# Altium project RGB_SL.PrjPcb
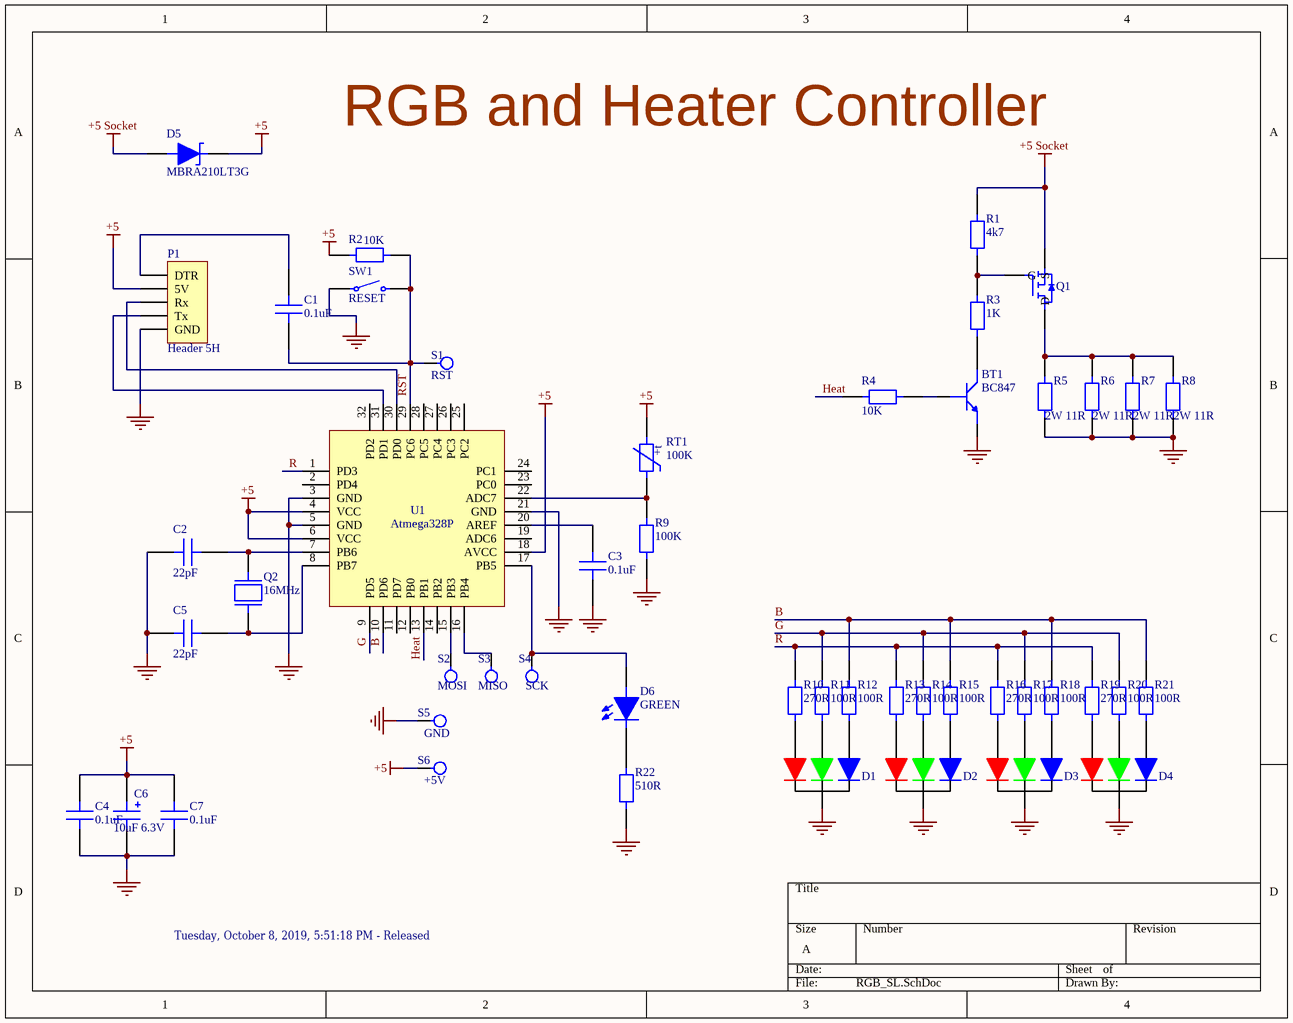
[diagram p0: RGB_SL.SchDoc]
1 sheet, 48 parts. Net scope: global (net labels, ports and power ports of the same name join across sheets).
Board file: RGB_SL.PcbDoc

## Sheet RGB_SL.SchDoc
size A

### Parts
BT1  BC847  [SOT95P240X100-3M]
C1  0.1uF  [0805 Ceramic Capacitor]
C2  22pF  [0805 Ceramic Capacitor]
C3  0.1uF  [0805 Ceramic Capacitor]
C4  0.1uF  [0805 Ceramic Capacitor]
C5  22pF  [0805 Ceramic Capacitor]
C6  10uF 6.3V  [CAP MP3216X16M]
C7  0.1uF  [0805 Ceramic Capacitor]
D1  LED RGB  [LED RGB]  (value not drawn)
D2  LED RGB  [LED RGB]  (value not drawn)
D3  LED RGB  [LED RGB]  (value not drawn)
D4  LED RGB  [LED RGB]  (value not drawn)
D5  MBRA210LT3G  [DIOM4326X22M]
D6  GREEN  [Led G]
P1  Header 5H  [HDR1X5H]
Q1  MOSFET P-Ch  [DPAK254P1524X483-3M]  (value not drawn)
Q2  16MHz  [Crystal]
R1  4k7  [0805 Res]
R2  10K  [0805 Res]
R3  1K  [0805 Res]
R4  10K  [0805 Res]
R5  2W 11R  [RES T/H 2W]
R6  2W 11R  [RES T/H 2W]
R7  2W 11R  [RES T/H 2W]
R8  2W 11R  [RES T/H 2W]
R9  100K  [0805 Res]
R10  270R  [1206 RES]
R11  100R  [1206 RES]
R12  100R  [1206 RES]
R13  270R  [1206 RES]
R14  100R  [1206 RES]
R15  100R  [1206 RES]
R16  270R  [1206 RES]
R17  100R  [1206 RES]
R18  100R  [1206 RES]
R19  270R  [1206 RES]
R20  100R  [1206 RES]
R21  100R  [1206 RES]
R22  510R  [0805 Res]
RT1  100K  [THERMISTOR]
S1  RST  [Test Pad]  (no BOM)
S2  MOSI  [Test Pad]  (no BOM)
S3  MISO  [Test Pad]  (no BOM)
S4  SCK  [Test Pad]  (no BOM)
S5  GND  [Test Pad]  (no BOM)
S6  +5V  [Test Pad]  (no BOM)
SW1  RESET  [SWITCH]
U1  Atmega328P  [TQFP80P900X900X120-32M]

### Nets
+5: C4.2 C6.1 C7.2 D5.1 P1.2(5V) R2.1 RT1.2 S6.1 U1.4(VCC) U1.6(VCC) U1.18(AVCC)
+5 Socket: D5.2 Q1.3(S) R1.2
GND: BT1.2 C2.1 C3.1 C4.1 C5.1 C6.2 C7.1 D1.3 D2.3 D3.3 D4.3 P1.5(GND) R5.1 R6.1 R7.1 R8.1 R9.1 R22.1 S5.1 SW1.1 U1.3(GND) U1.5(GND) U1.21(GND)
B: R12.2 R15.2 R18.2 R21.2 U1.10(PD6)
G: R11.2 R14.2 R17.2 R20.2 U1.9(PD5)
Heat: R4.1 U1.13(PB1)
R: R10.2 R13.2 R16.2 R19.2 U1.1(PD3)
RST: C1.1 R2.2 S1.1 SW1.2 U1.29(PC6)
NetBT1_1: BT1.1 R4.2
NetBT1_3: BT1.3 R3.1
NetC1_2: C1.2 P1.1(DTR)
NetC2_2: C2.2 Q2.1 U1.7(PB6)
NetC3_2: C3.2 U1.20(AREF)
NetC5_2: C5.2 Q2.2 U1.8(PB7)
NetD1_1: D1.1(B) R12.1
NetD1_2: D1.2(R) R10.1
NetD1_4: D1.4(G) R11.1
NetD2_1: D2.1(B) R15.1
NetD2_2: D2.2(R) R13.1
NetD2_4: D2.4(G) R14.1
NetD3_1: D3.1(B) R18.1
NetD3_2: D3.2(R) R16.1
NetD3_4: D3.4(G) R17.1
NetD4_1: D4.1(B) R21.1
NetD4_2: D4.2(R) R19.1
NetD4_4: D4.4(G) R20.1
NetD6_1: D6.1 S4.1 U1.17(PB5)
NetD6_2: D6.2 R22.2
NetP1_3: P1.3(Tx) U1.31(PD1)
NetP1_4: P1.4(Rx) U1.30(PD0)
NetQ1_1: Q1.1(G) R1.1 R3.2
NetQ1_4: Q1.4(D) R5.2 R6.2 R7.2 R8.2
NetR9_2: R9.2 RT1.1 U1.22(ADC7)
NetS2_1: S2.1 U1.15(PB3)
NetS3_1: S3.1 U1.16(PB4)

Not connected (* = marked no-connect by the designer): U1 2(PD4) 11(PD7) 12(PB0) 14(PB2) 19(ADC6) 23(PC0) 24(PC1) 25(PC2) 26(PC3) 27(PC4) 28(PC5) 32(PD2)

### Notes on the sheet
- RGB and Heater Controller
- ‎Tuesday, ‎October ‎8, ‎2019, ‏‎5:51:18 PM - Released
- (in symbol MF52A1104J3950) +t

### Library data of the parts
BT1 = BC847AE6327: Trans NPN 45V 0.1A Automotive 3-Pin SOT-23 T/R GP BJT; Manufacturer: Infineon; Max Power Dissipation: 330mW; Frequency: 250MHz; Max Collector Current: 100mA; Collector Emitter Voltage (VCEO): 600mV; Collector Base Voltage (VCBO): 50V; Number of Elements: 1; Emitter Base Voltage (VEBO): 6V; Supplier 1: Digi-Key; Supplier Part Number 1: BC847AE6327HTSA1CT-ND; Manufacturer Part Number: BC847AE6327; Stock 1: 58887; Pricing 1: 1=0.19, 10=0.175, 100=0.0951, 500=0.0585, 1000=0.0399 (USD); Mount: Surface Mount; Case/Package: SOT-23-3; Number of Pins: 3; Min Operating Temperature: -65°C; Max Operating Temperature: 150°C; Packaging: Tape and Reel; Polarity: NPN; Transition Frequency: 250MHz; Collector Emitter Breakdown Voltage: 45V; Max Breakdown Voltage: 45V; Power Dissipation: 330mW; Current Rating: 100mA; Voltage Rating (DC): 45V; Radiation Hardening: No; Lead Free: Lead Free; Halogen Free: Not Halogen Free; ComponentLink1URL: http://www.infineon.com/dgdl/bc847series_bc848series_bc849series_bc850series.pdf?folderId=db3a304314dca389011541d30fa21656&fileId=db3a304314dca389011541d4630a1657&src-supplier=Avnet; ComponentLink1Description: http://www.infineon.com/dgdl/bc847series_bc848series_bc849series_bc850series.pdf?folderId=db3a304314dca389011541d30fa21656&fileId=db3a304314dca389011541d4630a1657&src-supplier=Avnet; ComponentLink2URL: http://www.mouser.com/ds/2/196/bc847series_bc848series_bc849series_bc850series-55535.pdf?src-supplier=Mouser; ComponentLink2Description: http://www.mouser.com/ds/2/196/bc847series_bc848series_bc849series_bc850series-55535.pdf?src-supplier=Mouser; ComponentLink3URL: https://www.infineon.com/dgdl/Infineon-BC847SERIES_BC848SERIES_BC849SERIES_BC850SERIES-DS-v01_01-en.pdf?fileId=db3a304314dca389011541d4630a1657&src-supplier=Digi-Key; ComponentLink3Description: https://www.infineon.com/dgdl/Infineon-BC847SERIES_BC848SERIES_BC849SERIES_BC850SERIES-DS-v01_01-en.pdf?fileId=db3a304314dca389011541d4630a1657&src-supplier=Digi-Key; ComponentLink4URL: http://components.arrow.com/part/dataview/53356285S7690205N2051?src-supplier=Arrow; ComponentLink4Description: http://components.arrow.com/part/dataview/53356285S7690205N2051?src-supplier=Arrow; ComponentLink5URL: http://components.arrow.com/part/dataview/0323_00171840?src-supplier=Arrow+Europe; ComponentLink5Description: http://components.arrow.com/part/dataview/0323_00171840?src-supplier=Arrow+Europe; ComponentLink6URL: https://www.verical.com/server-webapp/html/getDatasheet?partID=730888&src-supplier=Verical; ComponentLink6Description: https://www.verical.com/server-webapp/html/getDatasheet?partID=730888&src-supplier=Verical; Category: Transistors
C1 C3 C4 C7 = VJ0805Y104KXAAT: Ceramic Cap 0.1uF 50 V 10% MLCC - SMD/SMT; Manufacturer: Vishay Vitramon; Capacitance: 100nF; Voltage Rating: 50V; Dielectric: X7R; Supplier 1: Digi-Key; Supplier Part Number 1: 720-1383-1-ND; Manufacturer Part Number: VJ0805Y104KXAAT; Stock 1: 151633; Pricing 1: 1=0.34, 10=0.234, 100=0.1404, 500=0.1053, 1000=0.0889 (USD); Mount: Surface Mount; Case/Package: 0805; Weight: 0.000194oz; Case Code (Metric): 2012; Case Code (Imperial): 0805; Min Operating Temperature: -55°C; Max Operating Temperature: 125°C; Package Quantity: 1; Packaging: Tape and Reel; Tolerance: 10%; Voltage Rating (DC): 50V; Termination: SMD/SMT; Voltage: 50V; Length: 2mm; Height: 1.45mm; Width: 0.049inch; Thickness: 0.057inch; Depth: 1.25mm; Radiation Hardening: No; REACH SVHC: Unknown; Lead Free: Lead Free; ComponentLink1URL: http://www.mouser.com/ds/2/427/vjcommercialseries-222796.pdf?src-supplier=Mouser; ComponentLink1Description: http://www.mouser.com/ds/2/427/vjcommercialseries-222796.pdf?src-supplier=Mouser; ComponentLink2URL: http://www.vishay.com/docs/45199/vjcommercialseries.pdf?src-supplier=Digi-Key; ComponentLink2Description: http://www.vishay.com/docs/45199/vjcommercialseries.pdf?src-supplier=Digi-Key; ComponentLink3URL: http://www.vishay.com/docs/45199/vjcommercialseries.pdf?src-supplier=Future+Electronics; ComponentLink3Description: http://www.vishay.com/docs/45199/vjcommercialseries.pdf?src-supplier=Future+Electronics; Category: Capasitors
C2 C5 = VJ0805A220JXACW1BC: Ceramic Cap 22 pF 50 V ±5 % Tolerance C0G/NP0 SMT Multilayer; Manufacturer: Vishay; Dielectric Material: Tantalum; Tolerance: 5%; Voltage Rating: 50V; Dielectric: C0G; Temperature Coefficient: 0ppm/°C; Supplier 1: Digi-Key; Supplier Part Number 1: 720-1601-1-ND; Manufacturer Part Number: VJ0805A220JXACW1BC; Stock 1: 7193; Pricing 1: 1=0.19, 10=0.13, 100=0.0661, 500=0.0452, 1000=0.04 (USD); Mount: Surface Mount; Case/Package: 0805; Number of Pins: 2; Case Code (Imperial): 0805; Case Code (Metric): 2012; Min Operating Temperature: -55°C; Max Operating Temperature: 125°C; Capacitance: 22pF; Packaging: Tape and Reel; Voltage Rating (DC): 50V; Package Quantity: 4000; Termination: SMD/SMT; Length: 2mm; Height: 1.45mm; Width: 1.25mm; Thickness: 0.03inch; Depth: 1.25mm; Radiation Hardening: No; Lead Free: Lead Free; ComponentLink1URL: http://www.vishay.com/docs/28548/vjw1bcbascomseries.pdf?src-supplier=Future+Electronics; ComponentLink1Description: http://www.vishay.com/docs/28548/vjw1bcbascomseries.pdf?src-supplier=Future+Electronics; ComponentLink2URL: http://www.vishay.com/docs/28548/vjw1bcbascomseries.pdf?src-supplier=Digi-Key; ComponentLink2Description: http://www.vishay.com/docs/28548/vjw1bcbascomseries.pdf?src-supplier=Digi-Key; Category: Capasitors
C6 = 293D106X96R3A2TE3: CAP TANT 10UF 6.3V 10% 1206; Manufacturer: Vishay Sprague; Dielectric Material: Tantalum; ESR (Equivalent Series Resistance): 3.4R; Ripple Current: 150mA; Leakage Current: 600nA; Polarity: Polar; Dissipation Factor: 6%; Q Factor: 6; Supplier 1: Digi-Key; Supplier Part Number 1: 718-1126-1-ND; Manufacturer Part Number: 293D106X96R3A2TE3; Stock 1: 57716; Pricing 1: 1=0.3, 10=0.212, 100=0.127, 500=0.0952, 1000=0.0804 (USD); Mount: Surface Mount,PCB; Case/Package: 1206; Case Code (Metric): 3216; Case Code (Imperial): 1206; Min Operating Temperature: -55°C; Max Operating Temperature: 125°C; Capacitance: 10uF; Tolerance: 10%; Voltage Rating: 6.3V; Packaging: Tape and Reel; Voltage Rating (DC): 6.3V; Package Quantity: 1; Termination: SMD/SMT; Voltage: 6.3V; Features: General Purpose; Length: 3.2mm; Height: 1.6mm; Width: 1.6mm; Height - Seated (Max): 0.071inch; Depth: 1.6mm; Radiation Hardening: No; REACH SVHC: Unknown; Lead Free: Lead Free; ComponentLink1URL: http://www.vishay.com/docs/40002/293d.pdf?src-supplier=Avnet; ComponentLink1Description: http://www.vishay.com/docs/40002/293d.pdf?src-supplier=Avnet; ComponentLink2URL: http://www.farnell.com/datasheets/2045658.pdf?src-supplier=Element14; ComponentLink2Description: http://www.farnell.com/datasheets/2045658.pdf?src-supplier=Element14; ComponentLink3URL: http://documents.rs-components.com/techlib://itc_doclist_GB.htm?stockno=6843913&src-supplier=RSComponents; ComponentLink3Description: http://documents.rs-components.com/techlib://itc_doclist_GB.htm?stockno=6843913&src-supplier=RSComponents; ComponentLink4URL: https://www.alliedelec.com/m/d/7dc9f301682605e5c5665c787edb7bb9.pdf?src-supplier=Allied+Electronics; ComponentLink4Description: https://www.alliedelec.com/m/d/7dc9f301682605e5c5665c787edb7bb9.pdf?src-supplier=Allied+Electronics; ComponentLink5URL: http://www.vishay.com/docs/40002/293d.pdf?src-supplier=Digi-Key; ComponentLink5Description: http://www.vishay.com/docs/40002/293d.pdf?src-supplier=Digi-Key; ComponentLink6URL: http://www.mouser.com/ds/2/427/293d-239871.pdf?src-supplier=Mouser; ComponentLink6Description: http://www.mouser.com/ds/2/427/293d-239871.pdf?src-supplier=Mouser; ComponentLink7URL: http://www.vishay.com/docs/40002/293d.pdf?src-supplier=Avnet+Europe; ComponentLink7Description: http://www.vishay.com/docs/40002/293d.pdf?src-supplier=Avnet+Europe; ComponentLink8URL: http://www.farnell.com/datasheets/438417.pdf?src-supplier=Element14; ComponentLink8Description: http://www.farnell.com/datasheets/438417.pdf?src-supplier=Element14; Category: Capacitors
D1-D4 = HV-5RGB25: LED RGB DIFFUSED 5MM T/H; Manufacturer: Inolux; Color: Blue,Green,Red; Lens Color: Colorless; Lens Style: Round,Domed; Element Configuration: Common Cathode; Lens Transparency: Clear; Luminous Intensity: 2000mcd; Forward Voltage: 3.4V; Test Current: 20mA; Viewing Angle: 25°; Dominant Wavelength: 470nm; Supplier 1: Digi-Key; Supplier Part Number 1: 1830-1015-ND; Manufacturer Part Number: HV-5RGB25; Stock 1: 3004; Pricing 1: 1=1.02, 10=0.829, 100=0.51, 500=0.4335, 1000=0.357, 2500=0.3392, 5000=0.3315, 10000=0.3239, 25000=0.3188 (USD); Mount: Through Hole; Case/Package: Radial; Packaging: Bulk; Height: 8.9mm; Lens Size: 5mm; ComponentLink1URL: http://www.inolux-corp.com/datasheet/Inolux%20Lamp/TH%20Lamp/HV-5RGBXX%205mm%20Full-Color%20Series.pdf?src-supplier=Digi-Key; ComponentLink1Description: http://www.inolux-corp.com/datasheet/Inolux%20Lamp/TH%20Lamp/HV-5RGBXX%205mm%20Full-Color%20Series.pdf?src-supplier=Digi-Key; Category: Optoelectronics
D5 = MBRA210LT3G: DIODE SCHOTTKY 10V 2A SMA; Manufacturer: ON Semiconductor; Max Surge Current: 160A; Forward Voltage: 350mV; Peak Reverse Current: 700uA; Element Configuration: Single; Polarity: Standard; Supplier 1: Digi-Key; Supplier Part Number 1: MBRA210LT3GOSCT-ND; Manufacturer Part Number: MBRA210LT3G; Stock 1: 23902; Pricing 1: 1=0.48, 10=0.411, 100=0.3072, 500=0.2413, 1000=0.1865 (USD); Case/Package: CASE 403D SMA; Number of Pins: 2; Contact Plating: Tin,Matte; Min Operating Temperature: -55°C; Max Operating Temperature: 125°C; Package Quantity: 1; Forward Current: 2A; Packaging: Tape and Reel; Average Rectified Current: 2A; Max Reverse Leakage Current: 700uA; Max Repetitive Reverse Voltage (Vrrm): 10V; Max Forward Surge Current (Ifsm): 160A; Peak Non-Repetitive Surge Current: 160A; Voltage Rating (DC): 10V; Current Rating: 2A; Output Current: 2A; Max Reverse Voltage (DC): 10V; Length: 4.57mm; Height: 2.05mm; Width: 2.92mm; Radiation Hardening: No; REACH SVHC: No SVHC; Lead Free: Lead Free; Halogen Free: Halogen Free; ComponentLink1URL: http://www.onsemi.com/pub/Collateral/MBRA210LT3-D.PDF?src-supplier=Digi-Key; ComponentLink1Description: http://www.onsemi.com/pub/Collateral/MBRA210LT3-D.PDF?src-supplier=Digi-Key; ComponentLink2URL: http://www.mouser.com/ds/2/308/MBRA210LT3-D-76406.pdf?src-supplier=Mouser; ComponentLink2Description: http://www.mouser.com/ds/2/308/MBRA210LT3-D-76406.pdf?src-supplier=Mouser; ComponentLink3URL: http://www.farnell.com/datasheets/1796182.pdf?src-supplier=Element14; ComponentLink3Description: http://www.farnell.com/datasheets/1796182.pdf?src-supplier=Element14; ComponentLink4URL: http://www.onsemi.com/pub/Collateral/MBRA210LT3-D.PDF?src-supplier=Avnet; ComponentLink4Description: http://www.onsemi.com/pub/Collateral/MBRA210LT3-D.PDF?src-supplier=Avnet; ComponentLink5URL: http://www.onsemi.com/pub/Collateral/MBRA210LT3-D.PDF?src-supplier=Future+Electronics; ComponentLink5Description: http://www.onsemi.com/pub/Collateral/MBRA210LT3-D.PDF?src-supplier=Future+Electronics; Category: Diodes
D6 = CMD17-21VGD/TR8: LED GREEN DIFFUSED 0805 SMD; Manufacturer: VCC CHML; Luminous Intensity: 7mcd; Viewing Angle: 140°; Forward Voltage: 2.1V; Wavelength: 570nm; Lens Style: Rectangular,Diffused,Tinted,Colored; Forward Current: 20mA; Power Rating: 105mW; Number of Elements: 1; Reverse Voltage (DC): 5V; Supplier 1: Digi-Key; Supplier Part Number 1: L62505CT-ND; Manufacturer Part Number: CMD17-21VGD/TR8; Stock 1: 7282; Pricing 1: 1=0.49, 10=0.357, 100=0.2328, 500=0.1674, 1000=0.131 (USD); Mount: Surface Mount; Case/Package: 0805; Number of Pins: 2; Color: Green; Case Code (Metric): 2012; Case Code (Imperial): 0805; Min Operating Temperature: -40°C; Max Operating Temperature: 85°C; Packaging: Tape and Reel; Package Quantity: 3000; Illumination Color: Green; Test Current: 20mA; Power Dissipation: 105mW; Number of LEDs: 1; Reverse Voltage: 5V; Length: 2mm; Height: 1.1mm; Width: 1.25mm; Depth: 1.25mm; REACH SVHC: Unknown; Lead Free: Lead Free; ComponentLink1URL: http://www.farnell.com/datasheets/2059681.pdf?src-supplier=Element14; ComponentLink1Description: http://www.farnell.com/datasheets/2059681.pdf?src-supplier=Element14; ComponentLink2URL: http://vcclite.com/_pdf/CMD17-21%20Series%20SMT%20LEDs%200805%20Package%20Size.pdf?src-supplier=Future+Electronics; ComponentLink2Description: http://vcclite.com/_pdf/CMD17-21%20Series%20SMT%20LEDs%200805%20Package%20Size.pdf?src-supplier=Future+Electronics; Category: Optoelectronics
P1 = Header 5H: Header, 5-Pin, Right Angle; LatestRevisionDate: 17-Jul-2002; LatestRevisionNote: Re-released for DXP Platform.; Publisher: Altium Limited
Q1 = NDP6020P: MOSFET P-Ch LL FET Enhancement Mode; Manufacturer: ON Semiconductor / Fairchild; Max Power Dissipation: 60W; Rise Time: 27ns; Rds On Max: 50mR; Input Capacitance: 1.59nF; Drain to Source Voltage (Vdss): 20V; Continuous Drain Current (ID): 24A; Fall Time: 70ns; Drain to Source Resistance: 5mR; Turn-Off Delay Time: 120ns; Number of Elements: 1; Turn-On Delay Time: 15ns; Threshold Voltage: -700mV; Element Configuration: Single; Drain to Source Breakdown Voltage: -20V; Gate to Source Voltage (Vgs): 8V; Current Rating: -24A; Supplier 1: Digi-Key; Supplier Part Number 1: NDP6020P-ND; Manufacturer Part Number: NDP6020P; Stock 1: 4487; Pricing 1: 1=1.73, 10=1.552, 100=1.2475, 500=1.025, 1000=0.8493 (USD); Mount: Through Hole; Case/Package: TO-220AB; Number of Pins: 3; Weight: 1.8g; Min Operating Temperature: -55°C; Max Operating Temperature: 175°C; Packaging: Rail/Tube; Package Quantity: 50; Power Dissipation: 60W; Voltage Rating (DC): -20V; On-State Resistance: 50mR; Length: 10.67mm; Height: 16.3mm; Width: 4.7mm; Radiation Hardening: No; REACH SVHC: No SVHC; Lead Free: Lead Free; ComponentLink1URL: https://www.verical.com/server-webapp/html/getDatasheet?partID=59735&src-supplier=Verical; ComponentLink1Description: https://www.verical.com/server-webapp/html/getDatasheet?partID=59735&src-supplier=Verical; ComponentLink2URL: https://www.fairchildsemi.com/datasheets/ND/NDB6020P.pdf?src-supplier=Avnet; ComponentLink2Description: https://www.fairchildsemi.com/datasheets/ND/NDB6020P.pdf?src-supplier=Avnet; ComponentLink3URL: http://www.fairchildsemi.com/datasheets/ND/NDB6020P.pdf?src-supplier=Digi-Key; ComponentLink3Description: http://www.fairchildsemi.com/datasheets/ND/NDB6020P.pdf?src-supplier=Digi-Key; ComponentLink4URL: http://www.fairchildsemi.com/ds/ND/NDP6020P.pdf?src-supplier=Future+Electronics; ComponentLink4Description: http://www.fairchildsemi.com/ds/ND/NDP6020P.pdf?src-supplier=Future+Electronics; ComponentLink5URL: http://www.fairchildsemi.com/ds/ND/NDB6020P.pdf?src-supplier=Avnet+Europe; ComponentLink5Description: http://www.fairchildsemi.com/ds/ND/NDB6020P.pdf?src-supplier=Avnet+Europe; ComponentLink6URL: http://www.produktinfo.conrad.com/datenblaetter/1200000-1299999/001264959-da-01-en-MOSFET_P_CH_20V_24_NDP6020P_TO_220_3_FSC.pdf?src-supplier=Conrad; ComponentLink6Description: http://www.produktinfo.conrad.com/datenblaetter/1200000-1299999/001264959-da-01-en-MOSFET_P_CH_20V_24_NDP6020P_TO_220_3_FSC.pdf?src-supplier=Conrad; Category: MOSFETs
Q2 = ECS-160-20-5PX-TR: CRYSTAL 16.0000MHZ 20PF SMD; Manufacturer: ECS International; Frequency Tolerance: 30ppm; ESR (Equivalent Series Resistance): 40R; Frequency Stability: 50ppm; Supplier 1: Digi-Key; Supplier Part Number 1: XC1282CT-ND; Manufacturer Part Number: ECS-160-20-5PX-TR; Stock 1: 5912; Pricing 1: 1=0.3, 10=0.25, 50=0.2248, 100=0.1997, 500=0.1898 (USD); Mount: Surface Mount; Number of Pins: 2; Min Operating Temperature: -10°C; Max Operating Temperature: 70°C; Package Quantity: 1000; Frequency: 16MHz; Load Capacitance: 20pF; Packaging: Tape and Reel; Tolerance: 30ppm; Termination: SMD/SMT; Length: 0.449inch; Height: 0.169inch; Width: 0.189inch; Lead Free: Lead Free; ComponentLink1URL: http://www.ecsxtal.com/store/pdf/partnumber4.pdf?src-supplier=Digi-Key; ComponentLink1Description: http://www.ecsxtal.com/store/pdf/partnumber4.pdf?src-supplier=Digi-Key; ComponentLink2URL: http://www.ecsxtal.com/store/pdf/csm-7x.pdf?src-supplier=Digi-Key; ComponentLink2Description: http://www.ecsxtal.com/store/pdf/csm-7x.pdf?src-supplier=Digi-Key; Category: Crystals; Case/Package: HC-49/US
R1 = CRCW08054K70JNEAC: RES SMD 4.7K Ohm 5% 1/8W ±200ppm/°C Molded SMD Paper T/R; Manufacturer: Vishay; Power Rating: 125mW; Resistance: 4.7kR; Supplier 1: Digi-Key; Supplier Part Number 1: 541-4165-1-ND; Manufacturer Part Number: CRCW08054K70JNEAC; Stock 1: 137912; Pricing 1: 1=0.1, 10=0.04, 100=0.0164, 1000=0.0074, 2500=0.0064 (USD); Case/Package: 0805; Tolerance: 5%; Lead Free: Lead Free; ComponentLink1URL: http://www.vishay.com/docs/28773/crcwce3.pdf?src-supplier=Digi-Key; ComponentLink1Description: http://www.vishay.com/docs/28773/crcwce3.pdf?src-supplier=Digi-Key; ComponentLink2URL: http://datasheet.octopart.com/CRCW08054K70JNEAC-Vishay-datasheet-100063072.pdf?src-supplier=Future+Electronics; ComponentLink2Description: http://datasheet.octopart.com/CRCW08054K70JNEAC-Vishay-datasheet-100063072.pdf?src-supplier=Future+Electronics; Category: Resistors
R2 R4 = CRCW080510K0FKTA: RES SMD 10K OHM 1% 1/8W 0805; Manufacturer: Vishay Dale; Resistance: 10kR; Power Rating: 125mW; Voltage Rating: 150V; Temperature Coefficient: 100ppm/°C; Supplier 1: Digi-Key; Supplier Part Number 1: 541-3016-1-ND; Manufacturer Part Number: CRCW080510K0FKTA; Stock 1: 27927; Pricing 1: 1=0.15, 10=0.135, 100=0.0521, 1000=0.0229, 2500=0.0198 (USD); Mount: Surface Mount; Case/Package: 0805; Number of Pins: 2; Weight: 0.000194oz; Case Code (Metric): 2012; Case Code (Imperial): 0805; Contact Plating: Tin,Lead; Min Operating Temperature: -55°C; Max Operating Temperature: 155°C; Tolerance: 1%; Packaging: Tape and Reel; Package Quantity: 5000; Composition: Thick Film; Number of Terminations: 2; Military Standard: Not; Max Power Dissipation: 125mW; Voltage Rating (DC): 150V; Power Dissipation: 125mW; Features: Automotive AEC-Q200; Length: 2mm; Height: 0.02inch; Width: 0.049inch; Depth: 1.25mm; Radiation Hardening: No; REACH SVHC: Unknown; Lead Free: Contains Lead; ComponentLink1URL: http://www.vishay.com/docs/20008/dcrcw.pdf?src-supplier=Digi-Key; ComponentLink1Description: http://www.vishay.com/docs/20008/dcrcw.pdf?src-supplier=Digi-Key; ComponentLink2URL: http://components.arrow.com/part/dataview/4072655S1681230N6892?src-supplier=Arrow; ComponentLink2Description: http://components.arrow.com/part/dataview/4072655S1681230N6892?src-supplier=Arrow; ComponentLink3URL: http://www.vishay.com/docs/20008/dcrcw.pdf?src-supplier=Avnet; ComponentLink3Description: http://www.vishay.com/docs/20008/dcrcw.pdf?src-supplier=Avnet; ComponentLink4URL: http://www.vishay.com/docs/20008/dcrcw.pdf?src-supplier=Future+Electronics; ComponentLink4Description: http://www.vishay.com/docs/20008/dcrcw.pdf?src-supplier=Future+Electronics; Category: Resistors
R3 = CRCW08051K00FKEA: RES SMD 1K OHM 1% 1/8W 0805; Manufacturer: Vishay Dale; Voltage Rating: 150V; Power Rating: 125mW; Resistance: 1kR; Temperature Coefficient: 100ppm/°C; Supplier 1: Digi-Key; Supplier Part Number 1: 541-1.00KCDKR-ND; Manufacturer Part Number: CRCW08051K00FKEA; Stock 1: 669031; Pricing 1: 1=0.1, 10=0.066, 100=0.0267, 1000=0.012, 2500=0.0104 (USD); Case/Package: 0805; Number of Pins: 2; Weight: 0.000194oz; Case Code (Imperial): 0805; Case Code (Metric): 2012; Contact Plating: Tin; Min Operating Temperature: -55°C; Max Operating Temperature: 155°C; Packaging: Tape and Reel; Package Quantity: 5000; Tolerance: 1%; Composition: Thick Film; Termination: SMD/SMT; Military Standard: Not; Voltage Rating (DC): 150V; Length: 2mm; Height: 0.45mm; Width: 1.25mm; Depth: 1.25mm; Radiation Hardening: No; REACH SVHC: Unknown; Lead Free: Lead Free; ComponentLink1URL: http://uk.rs-online.com/webdocs/0d98/0900766b80d98b26.pdf?src-supplier=RSComponents; ComponentLink1Description: http://uk.rs-online.com/webdocs/0d98/0900766b80d98b26.pdf?src-supplier=RSComponents; ComponentLink2URL: http://www.farnell.com/datasheets/2310790.pdf?src-supplier=Element14; ComponentLink2Description: http://www.farnell.com/datasheets/2310790.pdf?src-supplier=Element14; ComponentLink3URL: http://www.vishay.com/docs/20035/dcrcwe3.pdf?src-supplier=Avnet; ComponentLink3Description: http://www.vishay.com/docs/20035/dcrcwe3.pdf?src-supplier=Avnet; ComponentLink4URL: https://www.distrelec.biz/Web/Downloads/a_/en/flD-CRCW-e3_data_en.pdf?mime=application%2Fpdf&src-supplier=Distrelec; ComponentLink4Description: https://www.distrelec.biz/Web/Downloads/a_/en/flD-CRCW-e3_data_en.pdf?mime=application%2Fpdf&src-supplier=Distrelec; ComponentLink5URL: http://www.vishay.com/docs/20035/dcrcwe3.pdf?src-supplier=Future+Electronics; ComponentLink5Description: http://www.vishay.com/docs/20035/dcrcwe3.pdf?src-supplier=Future+Electronics; ComponentLink6URL: http://www.vishay.com/docs/20035/dcrcwe3.pdf?src-supplier=Avnet+Europe; ComponentLink6Description: http://www.vishay.com/docs/20035/dcrcwe3.pdf?src-supplier=Avnet+Europe; Category: Resistors
R5-R8 = RR02J11RTB: RES T/H 11 Ohm 2W 5% ±300ppm/°C Conformal AXL Thru-Hole Ammo Pack; Manufacturer: TE Connectivity; Number of Resistors: 1; Voltage Rating: 500V; Supplier 1: Digi-Key; Supplier Part Number 1: A138257CT-ND; Manufacturer Part Number: RR02J11RTB; Stock 1: 3940; Pricing 1: 1=0.36, 10=0.308, 25=0.224, 50=0.1626, 100=0.1205, 250=0.0925, 500=0.0729 (USD); Mount: Axial; Case/Package: Axial; Min Operating Temperature: -55°C; Max Operating Temperature: 155°C; Resistance: 11R; Power Rating: 2W; Tolerance: 5%; Package Quantity: 1000; Termination: Axial; Temperature Coefficient: 300ppm/°C; Packaging: Bulk; Composition: Power resistor; Number of Terminations: 2; Diameter: 3.5mm; Length: 9mm; ELV: Compliant; ComponentLink1URL: http://www.mouser.com/ds/2/418/NG_DS_3-1773449-2_E-734362.pdf?src-supplier=Mouser; ComponentLink1Description: http://www.mouser.com/ds/2/418/NG_DS_3-1773449-2_E-734362.pdf?src-supplier=Mouser; ComponentLink2URL: http://datasheet.octopart.com/RR02J11RTB-TE-Connectivity-datasheet-62056503.pdf?src-supplier=Newark; ComponentLink2Description: http://datasheet.octopart.com/RR02J11RTB-TE-Connectivity-datasheet-62056503.pdf?src-supplier=Newark; ComponentLink3URL: http://datasheet.octopart.com/RR02J11RTB-Tyco-Electronics-datasheet-11120060.pdf?src-supplier=TE+Connectivity; ComponentLink3Description: http://datasheet.octopart.com/RR02J11RTB-Tyco-Electronics-datasheet-11120060.pdf?src-supplier=TE+Connectivity; ComponentLink4URL: http://datasheet.octopart.com/RR02J11RTB-TE-Connectivity-datasheet-14742579.pdf?src-supplier=TE+Connectivity; ComponentLink4Description: http://datasheet.octopart.com/RR02J11RTB-TE-Connectivity-datasheet-14742579.pdf?src-supplier=TE+Connectivity; ComponentLink5URL: http://datasheet.octopart.com/RR02J11RTB-TE-Connectivity-datasheet-12070016.pdf?src-supplier=TE+Connectivity; ComponentLink5Description: http://datasheet.octopart.com/RR02J11RTB-TE-Connectivity-datasheet-12070016.pdf?src-supplier=TE+Connectivity; ComponentLink6URL: http://datasheet.octopart.com/RR02J11RTB-TE-Connectivity-datasheet-11120284.pdf?src-supplier=TE+Connectivity; ComponentLink6Description: http://datasheet.octopart.com/RR02J11RTB-TE-Connectivity-datasheet-11120284.pdf?src-supplier=TE+Connectivity; Category: Resistors
R9 = TNPW0805100KFEEA: RES SMD 100K Ohm 1% 0.2W(1/5W) ±25ppm/C Sulfur Resistant Conformal Coated Pad SMD Automotive Medical T/R; Manufacturer: Vishay; Power Rating: 125mW; Resistance: 100kR; Voltage Rating: 150V; Temperature Coefficient: 25ppm/°C; Supplier 1: Digi-Key; Supplier Part Number 1: 541-3912-1-ND; Manufacturer Part Number: TNPW0805100KFEEA; Stock 1: 6678; Pricing 1: 1=0.42, 10=0.319, 100=0.134, 1000=0.0739, 2500=0.0693 (USD); Case/Package: 0805; Weight: 0.000194oz; Case Code (Imperial): 0805; Case Code (Metric): 2012; Contact Plating: Tin; Min Operating Temperature: -55°C; Max Operating Temperature: 125°C; Tolerance: 1%; Packaging: Tape and Reel; Composition: Thin Film; Termination: SMD/SMT; Length: 2mm; Height: 0.45mm; Width: 1.2mm; Radiation Hardening: No; Lead Free: Lead Free; ComponentLink1URL: http://www.vishay.com/docs/28758/tnpw_e3.pdf?src-supplier=Avnet; ComponentLink1Description: http://www.vishay.com/docs/28758/tnpw_e3.pdf?src-supplier=Avnet; ComponentLink2URL: http://www.vishay.com/docs/28758/tnpw_e3.pdf?src-supplier=Future+Electronics; ComponentLink2Description: http://www.vishay.com/docs/28758/tnpw_e3.pdf?src-supplier=Future+Electronics; Category: Resistors
R10 R13 R16 R19 = CRCW1206270RFKEAC: RES SMD 270 OHM 1% 1/4W 1206; Manufacturer: Vishay Semiconductors; Power Rating: 250mW; Temperature Coefficient: 100ppm/°C; Supplier 1: Digi-Key; Supplier Part Number 1: 541-4192-1-ND; Manufacturer Part Number: CRCW1206270RFKEAC; Stock 1: 60408; Pricing 1: 1=0.1, 10=0.077, 100=0.0295, 1000=0.013, 2500=0.0112 (USD); Mount: Surface Mount; Case/Package: 1206; Contact Plating: Tin; Min Operating Temperature: -55°C; Max Operating Temperature: 155°C; Composition: Thick Film; Termination: Wraparound; Tolerance: 1%; Resistance: 270R; Length: 3.2mm; Lead Free: Lead Free; ComponentLink1URL: http://www.vishay.com/docs/20035/dcrcwe3.pdf?src-supplier=Avnet+Asia; ComponentLink1Description: http://www.vishay.com/docs/20035/dcrcwe3.pdf?src-supplier=Avnet+Asia; ComponentLink2URL: http://www.vishay.com/docs/28773/crcwce3.pdf?src-supplier=Digi-Key; ComponentLink2Description: http://www.vishay.com/docs/28773/crcwce3.pdf?src-supplier=Digi-Key; Category: Resistors
R11 R12 R14 R15 R17 R18 R20 R21 = CRCW1206100RFKEAC: RES SMD 100 OHM 1% 1/4W 1206; Manufacturer: Vishay Semiconductors; Power Rating: 250mW; Temperature Coefficient: 100ppm/°C; Supplier 1: Digi-Key; Supplier Part Number 1: 541-3982-1-ND; Manufacturer Part Number: CRCW1206100RFKEAC; Stock 1: 85911; Pricing 1: 1=0.1, 10=0.077, 100=0.0295, 1000=0.013, 2500=0.0112 (USD); Mount: Surface Mount; Case/Package: 1206; Contact Plating: Tin; Min Operating Temperature: -55°C; Max Operating Temperature: 155°C; Composition: Thick Film; Termination: Wraparound; Tolerance: 1%; Resistance: 100R; Length: 3.2mm; Lead Free: Lead Free; ComponentLink1URL: http://www.vishay.com/docs/20035/dcrcwe3.pdf?src-supplier=Avnet+Asia; ComponentLink1Description: http://www.vishay.com/docs/20035/dcrcwe3.pdf?src-supplier=Avnet+Asia; ComponentLink2URL: http://www.vishay.com/docs/28773/crcwce3.pdf?src-supplier=Digi-Key; ComponentLink2Description: http://www.vishay.com/docs/28773/crcwce3.pdf?src-supplier=Digi-Key; Category: Resistors
R22 = CRCW0805510RFKEA: RES SMD 510 OHM 1% 1/8W 0805; Manufacturer: Vishay; Power Rating: 125mW; Voltage Rating: 150V; Temperature Coefficient: 100ppm/°C; Supplier 1: Digi-Key; Supplier Part Number 1: 541-510CCT-ND; Manufacturer Part Number: CRCW0805510RFKEA; Stock 1: 23412; Pricing 1: 1=0.1, 10=0.066, 100=0.0267, 1000=0.012, 2500=0.0104 (USD); Mount: Surface Mount; Case/Package: 0805; Weight: 0.000194oz; Case Code (Metric): 2012; Case Code (Imperial): 0805; Contact Plating: Tin; Min Operating Temperature: -55°C; Max Operating Temperature: 155°C; Packaging: Tape and Reel; Resistance: 510R; Tolerance: 1%; Package Quantity: 10; Composition: Thick Film; Number of Terminations: 2; Termination: SMD/SMT; Max Power Dissipation: 125mW; Voltage Rating (DC): 150V; Features: Automotive AEC-Q200; Military Standard: Not; Length: 2mm; Height: 0.45mm; Width: 0.049inch; Depth: 1.25mm; Radiation Hardening: No; REACH SVHC: Unknown; Lead Free: Lead Free; ComponentLink1URL: http://www.vishay.com/docs/20035/dcrcwe3.pdf?src-supplier=Digi-Key; ComponentLink1Description: http://www.vishay.com/docs/20035/dcrcwe3.pdf?src-supplier=Digi-Key; ComponentLink2URL: http://www.farnell.com/datasheets/2111203.pdf?src-supplier=Element14; ComponentLink2Description: http://www.farnell.com/datasheets/2111203.pdf?src-supplier=Element14; ComponentLink3URL: https://www.distrelec.biz/Web/Downloads/a_/en/flD-CRCW-e3_data_en.pdf?mime=application%2Fpdf&src-supplier=Distrelec; ComponentLink3Description: https://www.distrelec.biz/Web/Downloads/a_/en/flD-CRCW-e3_data_en.pdf?mime=application%2Fpdf&src-supplier=Distrelec; ComponentLink4URL: http://www.vishay.com/docs/20035/dcrcwe3.pdf?src-supplier=Avnet+Europe; ComponentLink4Description: http://www.vishay.com/docs/20035/dcrcwe3.pdf?src-supplier=Avnet+Europe; ComponentLink5URL: https://www.alliedelec.com/m/d/0c934d6939ccefa68dbe0b96d821c8cf.pdf?src-supplier=Allied+Electronics; ComponentLink5Description: https://www.alliedelec.com/m/d/0c934d6939ccefa68dbe0b96d821c8cf.pdf?src-supplier=Allied+Electronics; ComponentLink6URL: http://www.vishay.com/docs/20035/dcrcwe3.pdf?src-supplier=Future+Electronics; ComponentLink6Description: http://www.vishay.com/docs/20035/dcrcwe3.pdf?src-supplier=Future+Electronics; ComponentLink7URL: http://uk.rs-online.com/webdocs/0d98/0900766b80d98b26.pdf?src-supplier=RSComponents; ComponentLink7Description: http://uk.rs-online.com/webdocs/0d98/0900766b80d98b26.pdf?src-supplier=RSComponents; ComponentLink8URL: http://www.mouser.com/ds/2/427/dcrcwe3-109170.pdf?src-supplier=Mouser; ComponentLink8Description: http://www.mouser.com/ds/2/427/dcrcwe3-109170.pdf?src-supplier=Mouser; ComponentLink9URL: http://www.farnell.com/datasheets/2046716.pdf?src-supplier=Element14; ComponentLink9Description: http://www.farnell.com/datasheets/2046716.pdf?src-supplier=Element14; Category: Resistors
RT1 = MF52A1104J3950: THERMISTOR 100K OHM 5% BEAD; Manufacturer: Canadian Thermostats; Max Power Dissipation: 50mW; Supplier 1: Digi-Key; Supplier Part Number 1: 317-1264-ND; Manufacturer Part Number: MF52A1104J3950; Stock 1: 3676; Pricing 1: 1=0.45, 5=0.43, 10=0.383, 25=0.3528, 50=0.282, 100=0.2418, 500=0.2116, 1000=0.1814, 5000=0.1612 (USD); Mount: Through Hole; Min Operating Temperature: -55°C; Max Operating Temperature: 125°C; Package Quantity: 3000; Tolerance: 5%; Packaging: Bulk; ComponentLink1URL: http://www.cantherm.com/wp-content/uploads/2017/05/cantherm_mf52_1.pdf?src-supplier=Digi-Key; ComponentLink1Description: http://www.cantherm.com/wp-content/uploads/2017/05/cantherm_mf52_1.pdf?src-supplier=Digi-Key; Category: NTC Thermistors
S1-S6 = Test Pad
SW1 = FSMSMTR: SWITCH TACTILE SPST-NO 0.05A 24V; Manufacturer: TE Connectivity; Mechanical Life: 20000Cycles; Actuator Material: Polyamide; Current Rating: 50mA; Throw Configuration: SPST; Contact Resistance: 100mR; Operating Force: 180gf; Max Voltage Rating (DC): 12V; Illumination Type: Non-Illuminated,Illuminated; Switch Travel: 0.25mm; Switch Function: Off-Mom; Actuator Type: Standard; Actuator Length: 1.07mm; Supplier 1: Digi-Key; Supplier Part Number 1: 450-1758-6-ND; Manufacturer Part Number: FSMSMTR; Stock 1: 20359; Pricing 1: 1=0.47, 10=0.45, 25=0.442, 50=0.4254, 100=0.367, 250=0.3336, 500=0.317 (USD); Mount: Surface Mount; Case/Package: SMD/SMT; Contact Material: Brass; Contact Plating: Silver; Min Operating Temperature: -35°C; Max Operating Temperature: 85°C; Packaging: Tape and Reel; Package Quantity: 1800; Termination: Gull Wing; Voltage Rating (DC): 24V; Contact Current Rating: 50mA; Electrical Life: 20000Cycles; Orientation: Straight; Type: Switch; Max Current Rating: 50mA; Radiation Hardening: No; REACH SVHC: Unknown; Lead Free: Lead Free; ELV: Compliant; ComponentLink1URL: http://www.onlinecomponents.com/productFiles/mf-AO/eng_cat_1308390_0904_e3_e10_.pdf?src-supplier=Onlinecomponents.com; ComponentLink1Description: http://www.onlinecomponents.com/productFiles/mf-AO/eng_cat_1308390_0904_e3_e10_.pdf?src-supplier=Onlinecomponents.com; ComponentLink2URL: https://www.te.com/commerce/DocumentDelivery/DDEController?Action=srchrtrv&DocNm=1437566-3&DocType=Customer+Drawing&DocLang=English&src-supplier=Digi-Key; ComponentLink2Description: https://www.te.com/commerce/DocumentDelivery/DDEController?Action=srchrtrv&DocNm=1437566-3&DocType=Customer+Drawing&DocLang=English&src-supplier=Digi-Key; Category: Switches
U1 = ATMEGA328P-AUR: IC MCU 8BIT 32KB FLASH 32TQFP; Manufacturer: Microchip; Frequency: 40MHz; Interface: I2C,SPI,UART,USART; Oscillator Type: Internal; Peripherals: Brown-out Detect/Reset,POR,PWM,WDT; Number of I/Os: 32; Core Architecture: PIC; Supplier 1: Digi-Key; Supplier Part Number 1: ATMEGA328P-AURCT-ND; Manufacturer Part Number: ATMEGA328P-AUR; Stock 1: 19930; Pricing 1: 1=2.14, 25=1.9672, 100=1.7819 (USD); Case/Package: TQFP; Min Operating Temperature: -40°C; Max Operating Temperature: 85°C; Packaging: Cut Tape; Memory Type: FLASH; Memory Size: 32KB; Category: Integrated Circuits

## Assembly variants
No DIPs: not fitted D1 D2 D3 D4 P1 R5 R6 R7 R8